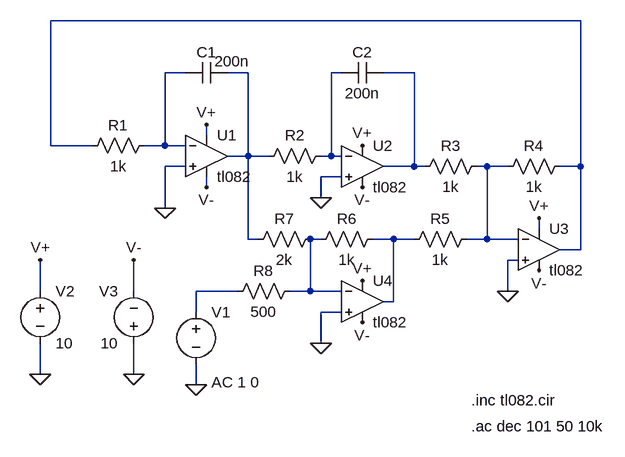
[diagram p0: schematic Experiment_04.asc]
Experiment_04.asc, the LTspice schematic file:
Version 4
SHEET 1 880 680
WIRE 672 -128 -144 -128
WIRE 64 -48 32 -48
WIRE 160 -48 128 -48
WIRE 304 -48 288 -48
WIRE 416 -48 368 -48
WIRE 96 48 96 32
WIRE -144 64 -144 -128
WIRE -80 64 -144 64
WIRE 32 64 32 -48
WIRE 32 64 0 64
WIRE 64 64 32 64
WIRE 160 80 160 -48
WIRE 160 80 128 80
WIRE 192 80 160 80
WIRE 288 80 288 -48
WIRE 288 80 272 80
WIRE 304 80 288 80
WIRE 64 96 32 96
WIRE 416 96 416 -48
WIRE 416 96 368 96
WIRE 432 96 416 96
WIRE 528 96 512 96
WIRE 560 96 528 96
WIRE 672 96 672 -128
WIRE 672 96 640 96
WIRE 304 112 272 112
WIRE 96 128 96 112
WIRE 272 144 272 112
WIRE 32 160 32 96
WIRE 608 192 608 176
WIRE 160 208 160 80
WIRE 176 208 160 208
WIRE 272 208 256 208
WIRE 384 208 352 208
WIRE 416 208 384 208
WIRE 528 208 528 96
WIRE 528 208 496 208
WIRE 576 208 528 208
WIRE 672 224 672 96
WIRE 672 224 640 224
WIRE 576 240 560 240
WIRE -160 288 -160 240
WIRE -16 288 -16 240
WIRE 144 288 80 288
WIRE 256 288 256 208
WIRE 256 288 224 288
WIRE 304 288 256 288
WIRE 560 288 560 240
WIRE 384 304 384 208
WIRE 384 304 368 304
WIRE 80 320 80 288
WIRE 304 320 272 320
WIRE 272 368 272 320
WIRE -160 416 -160 368
WIRE -16 416 -16 368
WIRE 80 432 80 400
FLAG 272 368 0
FLAG 560 288 0
FLAG 272 144 0
FLAG 32 160 0
FLAG 80 432 0
FLAG -16 416 0
FLAG -160 416 0
FLAG -160 240 V+
FLAG -16 240 V-
FLAG 96 128 V-
FLAG 336 128 V-
FLAG 608 256 V-
FLAG 336 336 V-
FLAG 96 32 V+
FLAG 336 64 V+
FLAG 608 176 V+
FLAG 336 272 V+
SYMBOL res 16 48 R90
WINDOW 0 0 56 VBottom 2
WINDOW 3 32 56 VTop 2
SYMATTR InstName R1
SYMATTR Value 1k
SYMBOL res 288 64 R90
WINDOW 0 0 56 VBottom 2
WINDOW 3 32 56 VTop 2
SYMATTR InstName R2
SYMATTR Value 1k
SYMBOL res 528 80 R90
WINDOW 0 0 56 VBottom 2
WINDOW 3 32 56 VTop 2
SYMATTR InstName R3
SYMATTR Value 1k
SYMBOL res 656 80 R90
WINDOW 0 0 56 VBottom 2
WINDOW 3 32 56 VTop 2
SYMATTR InstName R4
SYMATTR Value 1k
SYMBOL res 512 192 R90
WINDOW 0 0 56 VBottom 2
WINDOW 3 32 56 VTop 2
SYMATTR InstName R5
SYMATTR Value 1k
SYMBOL res 368 192 R90
WINDOW 0 0 56 VBottom 2
WINDOW 3 32 56 VTop 2
SYMATTR InstName R6
SYMATTR Value 1k
SYMBOL res 272 192 R90
WINDOW 0 0 56 VBottom 2
WINDOW 3 32 56 VTop 2
SYMATTR InstName R7
SYMATTR Value 2k
SYMBOL res 240 272 R90
WINDOW 0 0 56 VBottom 2
WINDOW 3 32 56 VTop 2
SYMATTR InstName R8
SYMATTR Value 500
SYMBOL cap 128 -64 R90
WINDOW 0 0 32 VBottom 2
WINDOW 3 -17 -7 VTop 2
SYMATTR InstName C1
SYMATTR Value 200n
SYMBOL cap 368 -64 R90
WINDOW 0 0 32 VBottom 2
WINDOW 3 32 32 VTop 2
SYMATTR InstName C2
SYMATTR Value 200n
SYMBOL voltage 80 304 R0
WINDOW 3 24 96 Invisible 2
WINDOW 123 24 124 Left 2
WINDOW 39 0 0 Left 0
SYMATTR Value SINE(0 1)
SYMATTR Value2 AC 1 0
SYMATTR InstName V1
SYMBOL voltage -160 272 R0
WINDOW 123 0 0 Left 0
WINDOW 39 0 0 Left 0
SYMATTR InstName V2
SYMATTR Value 10
SYMBOL voltage -16 384 R180
WINDOW 0 24 96 Left 2
WINDOW 3 24 16 Left 2
WINDOW 123 0 0 Left 0
WINDOW 39 0 0 Left 0
SYMATTR InstName V3
SYMATTR Value 10
SYMBOL Opamps\\opamp2 96 16 R0
SYMATTR InstName U1
SYMATTR Value tl082
SYMBOL Opamps\\opamp2 336 32 R0
SYMATTR InstName U2
SYMATTR Value tl082
SYMBOL Opamps\\opamp2 608 160 R0
SYMATTR InstName U3
SYMATTR Value tl082
SYMBOL Opamps\\opamp2 336 240 R0
SYMATTR InstName U4
SYMATTR Value tl082
TEXT 504 496 Left 2 !.ac dec 101 50 10k
TEXT 504 456 Left 2 !.inc tl082.cir

The netlist it stands for:
* Experiment_04.asc
R1 N002 N001 1k
R2 N004 N003 1k
R3 N006 N005 1k
R4 N001 N006 1k
R5 N006 N008 1k
R6 N008 N007 1k
R7 N007 N003 2k
R8 N007 N009 500
C1 N003 N002 200n
C2 N005 N004 200n
V1 N009 0 SINE(0 1) AC 1 0
V2 V+ 0 10
V3 0 V- 10
XU1 0 N002 V+ V- N003 tl082  ; pins In+ In- V+ V- OUT
XU2 0 N004 V+ V- N005 tl082  ; pins In+ In- V+ V- OUT
XU3 0 N006 V+ V- N001 tl082  ; pins In+ In- V+ V- OUT
XU4 0 N007 V+ V- N008 tl082  ; pins In+ In- V+ V- OUT
.ac dec 101 50 10k
.inc tl082.cir
.backanno
.end